# Altium schematic sheet C-10 PMIC.SchDoc
size 513 x 386 mm; Address1: 350W 9th Ave; Address2: Suite 206; Address3: Escondido CA 92025; Address4: United States; Revision: -; ENG_APP_DATE: --/--/--; DSN_APP_DATE: --/--/--; CHK_APP_DATE: --/--/--
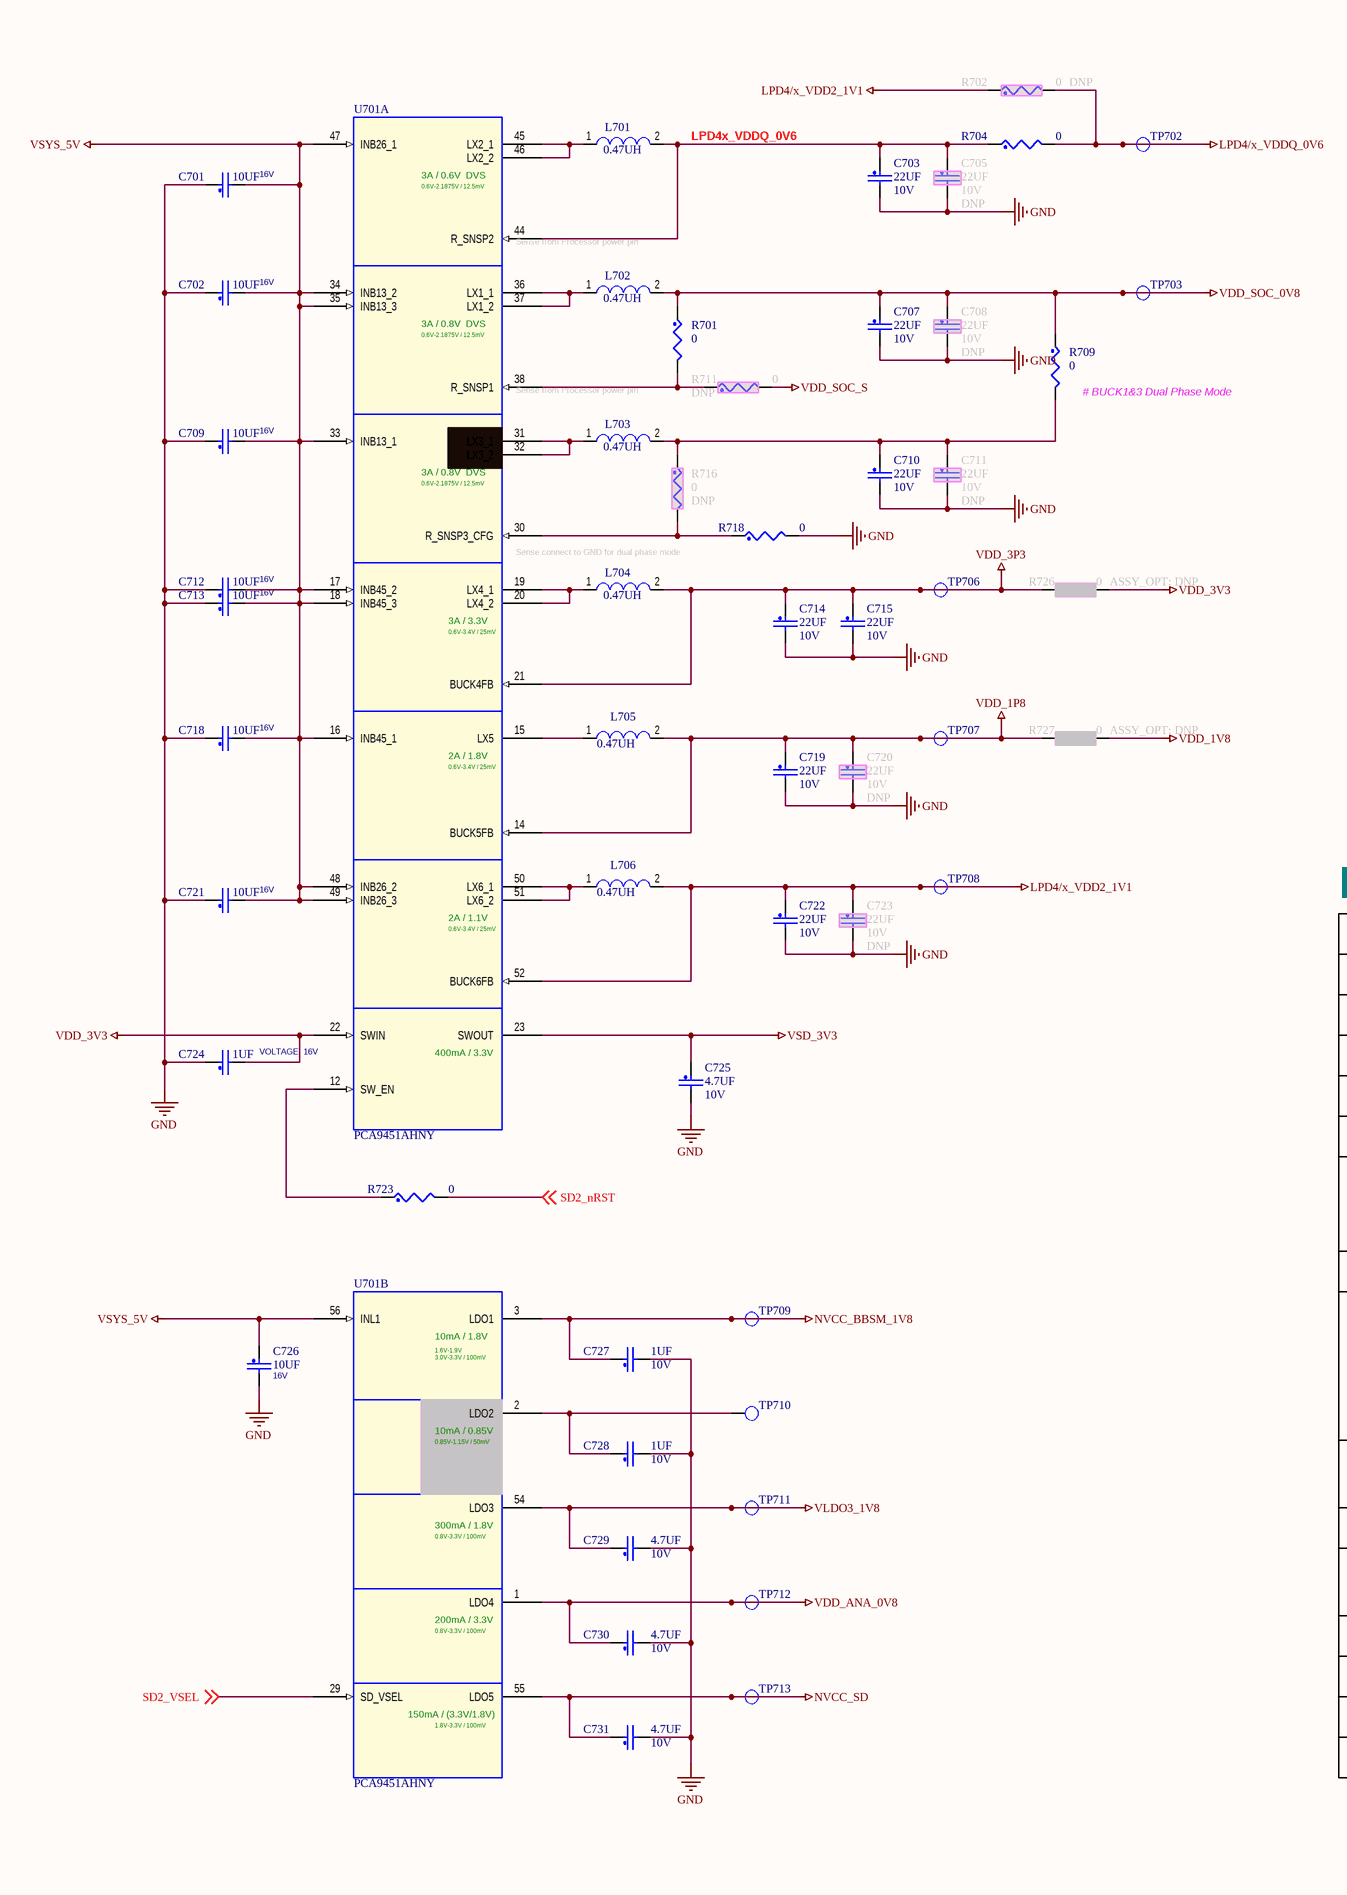
[diagram p0: C-10 PMIC.SchDoc, left]
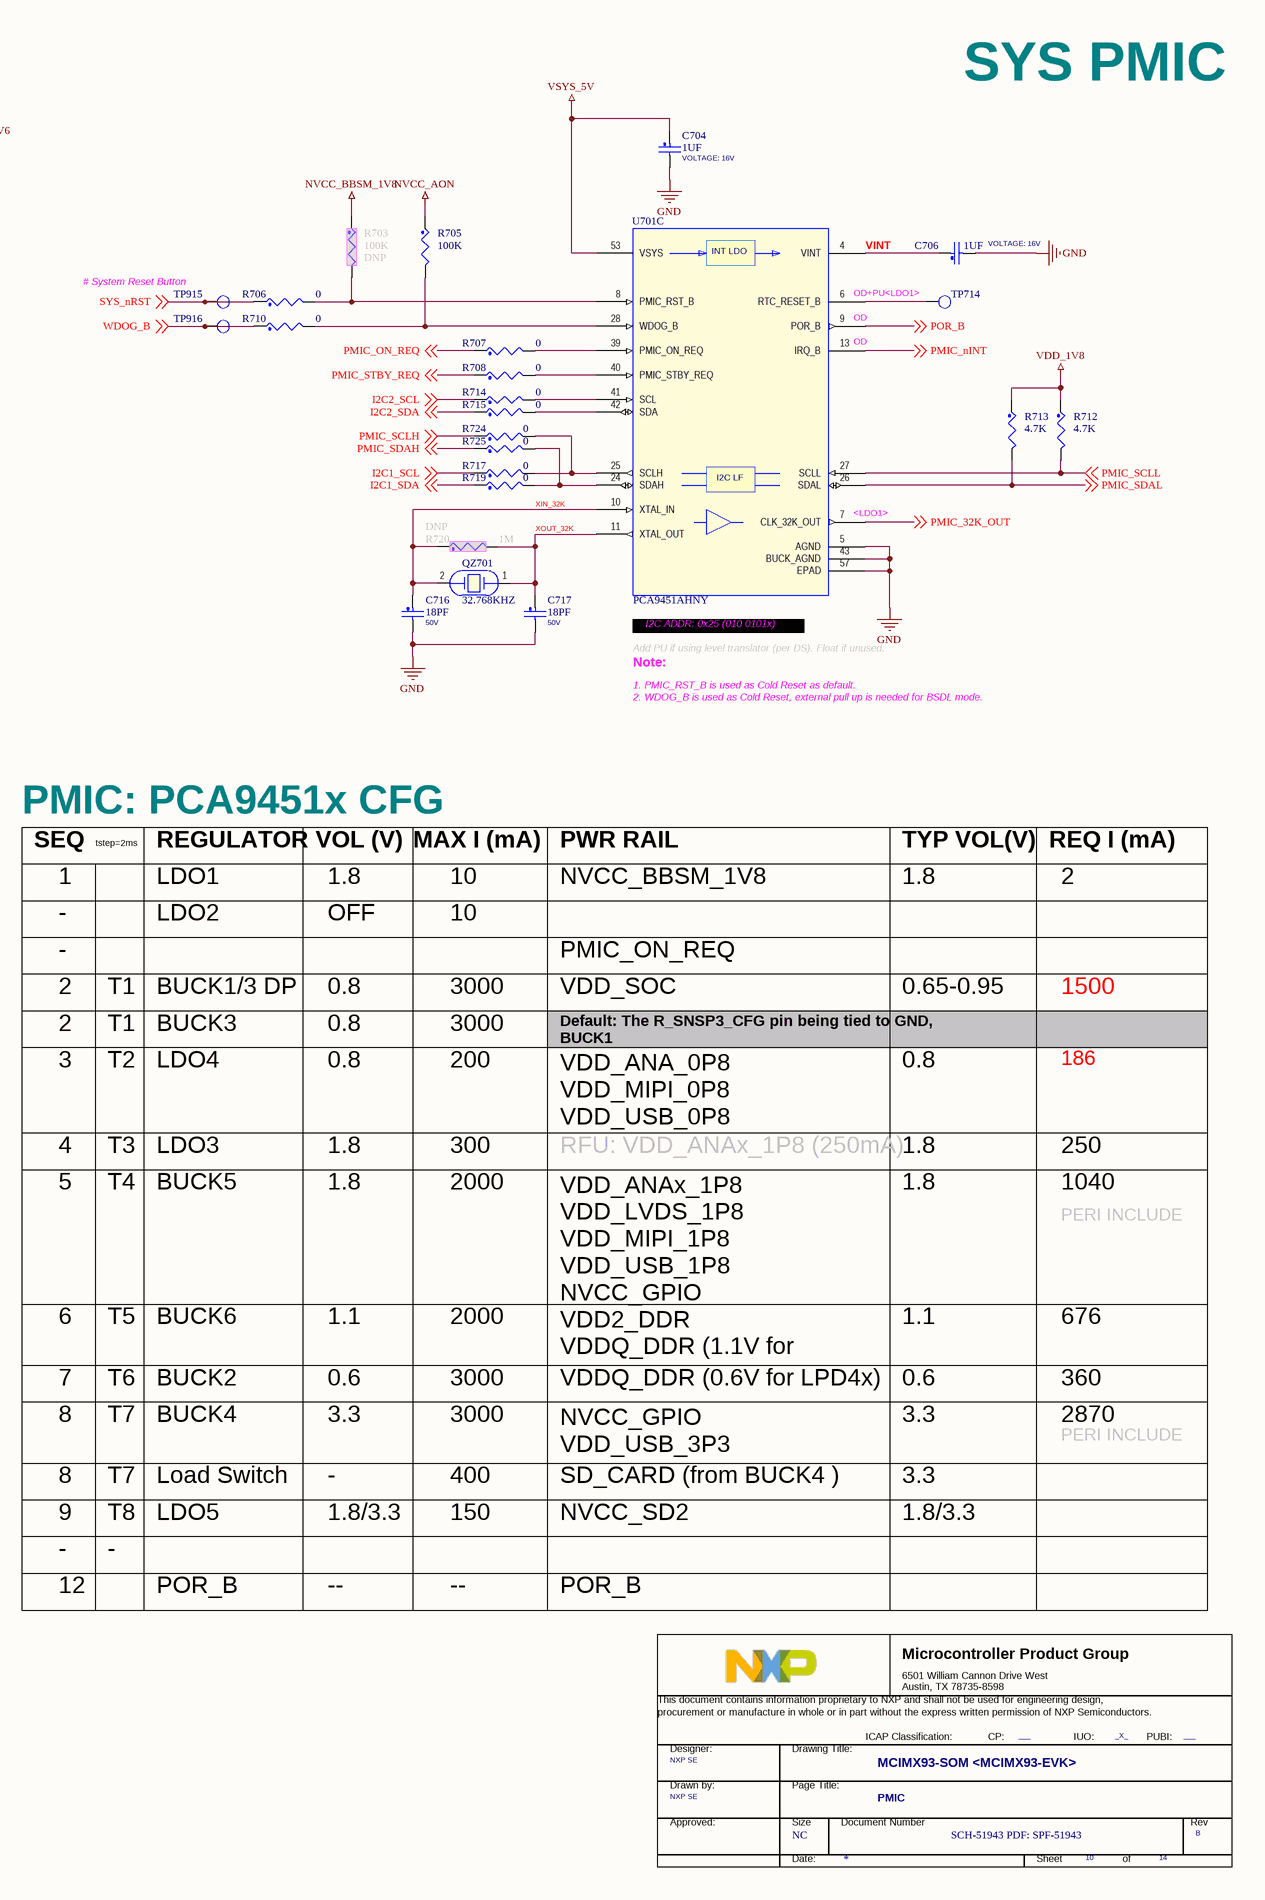
[diagram p1: C-10 PMIC.SchDoc, right]

## Parts
*  Doc: SCH-51943 PDF: SPF-51943  RevCode: B  Title: MCIMX93-SOM <MCIMX93-EVK>  Page Size: NC  Page Number: 10  Page Count: 14  PageTitle: PMIC  Designer: NXP SE  PUBI: ___  FIUO: _X_  (hidden comment: TitleBlock_MCPG)  (graphical)
C701  10UF  VOLTAGE: 16V  [CC0603]
C702  10UF  VOLTAGE: 16V  [CC0603]
C703  22UF  VOLTAGE: 10V  [CC0603]
C704  1UF  VOLTAGE: 16V  [0402_CC]
C705  22UF  ASSY_OPT: DNP  VOLTAGE: 10V  [CC0603]
C706  1UF  VOLTAGE: 16V  [0402_CC]
C707  22UF  VOLTAGE: 10V  [CC0603]
C708  22UF  ASSY_OPT: DNP  VOLTAGE: 10V  [CC0603]
C709  10UF  VOLTAGE: 16V  [CC0603]
C710  22UF  VOLTAGE: 10V  [CC0603]
C711  22UF  ASSY_OPT: DNP  VOLTAGE: 10V  [CC0603]
C712  10UF  VOLTAGE: 16V  [CC0603]
C713  10UF  VOLTAGE: 16V  [CC0603]
C714  22UF  VOLTAGE: 10V  [CC0603]
C715  22UF  VOLTAGE: 10V  [CC0603]
C716  18PF  VOLTAGE: 50V  [0201_CC]
C717  18PF  VOLTAGE: 50V  [0201_CC]
C718  10UF  VOLTAGE: 16V  [CC0603]
C719  22UF  VOLTAGE: 10V  [CC0603]
C720  22UF  ASSY_OPT: DNP  VOLTAGE: 10V  [CC0603]
C721  10UF  VOLTAGE: 16V  [CC0603]
C722  22UF  VOLTAGE: 10V  [CC0603]
C723  22UF  ASSY_OPT: DNP  VOLTAGE: 10V  [CC0603]
C724  1UF  VOLTAGE: 16V  [0402_CC]
C725  4.7UF  VOLTAGE: 10V  [cc0402_tol0p15]
C726  10UF  VOLTAGE: 16V  [CC0603]
C727  1UF  VOLTAGE: 10V  [0201_CC]
C728  1UF  VOLTAGE: 10V  [0201_CC]
C729  4.7UF  VOLTAGE: 10V  [cc0402_tol0p15]
C730  4.7UF  VOLTAGE: 10V  [cc0402_tol0p15]
C731  4.7UF  VOLTAGE: 10V  [cc0402_tol0p15]
L701  0.47UH  [ind_sph2520]
L702  0.47UH  [ind_sph2520]
L703  0.47UH  [ind_sph2520]
L704  0.47UH  [ind_sph2520]
L705  0.47UH  [IND_2016A]
L706  0.47UH  [IND_2016A]
QZ701  32.768KHZ  [XTAL2-3P2X1P5-SM]
R701  0  [0402_CC]
R702  0  ASSY_OPT: DNP  [0603_CC]
R703  100K  ASSY_OPT: DNP  [0402_CC]
R704  0  [0603_CC]
R705  100K  [0402_CC]
R706  0  [0402_CC]
R707  0  [0402_CC]
R708  0  [0402_CC]
R709  0  [0603_CC]
R710  0  [0402_CC]
R711  0  ASSY_OPT: DNP  [0402_CC]
R712  4.7K  [0402_CC]
R713  4.7K  [0402_CC]
R714  0  [0402_CC]
R715  0  [0402_CC]
R716  0  ASSY_OPT: DNP  [0402_CC]
R717  0  [0201_CC]
R718  0  [0402_CC]
R719  0  [0201_CC]
R720  1M  ASSY_OPT: DNP  [0201_CC]
R723  0  [0402_CC]
R724  0  [0201_CC]
R725  0  [0201_CC]
R726  0  ASSY_OPT: DNP  [RC0805_OV]
R727  0  ASSY_OPT: DNP  [RC0805_OV]
TP702  TP_35MIL  [testpoint_35mil]  (value not drawn)  (no BOM)
TP703  TP_35MIL  [testpoint_35mil]  (value not drawn)  (no BOM)
TP706  TP_35MIL  [testpoint_35mil]  (value not drawn)  (no BOM)
TP707  TP_35MIL  [testpoint_35mil]  (value not drawn)  (no BOM)
TP708  TP_35MIL  [testpoint_35mil]  (value not drawn)  (no BOM)
TP709  TP_35MIL  [testpoint_35mil]  (value not drawn)  (no BOM)
TP710  TP_35MIL  [testpoint_35mil]  (value not drawn)  (no BOM)
TP711  TP_35MIL  [testpoint_35mil]  (value not drawn)  (no BOM)
TP712  TP_35MIL  [testpoint_35mil]  (value not drawn)  (no BOM)
TP713  TP_35MIL  [testpoint_35mil]  (value not drawn)  (no BOM)
TP714  TP_35MIL  [testpoint_35mil]  (value not drawn)  (no BOM)
TP915  TP_35MIL  [testpoint_35mil]  (value not drawn)  (no BOM)
TP916  TP_35MIL  [testpoint_35mil]  (value not drawn)  (no BOM)
U701  PCA9451AHNY  [hvqfn56_0p4_7x7_ep4p7mm]  (parts A,B,C of 3)

## Nets
GND: C701.1 C702.1 C703.2 C704.2 C705.2 C706.2 C707.2 C708.2 C709.1 C710.2 C711.2 C712.1 C713.1 C714.2 C715.2 C716.2 C717.2 C718.1 C719.2 C720.2 C721.1 C722.2 C723.2 C724.1 C725.2 C726.2 C727.2 C728.2 C729.2 C730.2 C731.2 R718.2 U701.5(AGND) U701.43(BUCK_AGND) U701.57(EPAD)
LPD4/x_VDD2_1V1: C722.1 C723.1 L706.2 R702.1 TP708.1(TP) U701.52(BUCK6FB)
LPD4/x_VDDQ_0V6: R702.2 R704.2 TP702.1(TP)
NVCC_AON: R705.1
NVCC_BBSM_1V8: C727.1 R703.1 TP709.1(TP) U701.3(LDO1)
NVCC_SD: C731.1 TP713.1(TP) U701.55(LDO5)
VDD_1P8: C719.1 C720.1 L705.2 R727.1 TP707.1(TP) U701.14(BUCK5FB)
VDD_1V8: R712.1 R713.1 R727.2
VDD_3P3: C714.1 C715.1 L704.2 R726.1 TP706.1(TP) U701.21(BUCK4FB)
VDD_3V3: C724.2 R726.2 U701.22(SWIN)
VDD_ANA_0V8: C730.1 TP712.1(TP) U701.1(LDO4)
VDD_SOC_0V8: C707.1 C708.1 L702.2 R701.1 R709.1 TP703.1(TP)
VDD_SOC_S: R711.2
VLDO3_1V8: C729.1 TP711.1(TP) U701.54(LDO3)
VSD_3V3: C725.1 U701.23(SWOUT)
VSYS_5V: C701.2 C702.2 C704.1 C709.2 C712.2 C713.2 C718.2 C721.2 C726.1 U701.16(INB45_1) U701.17(INB45_2) U701.18(INB45_3) U701.33(INB13_1) U701.34(INB13_2) U701.35(INB13_3) U701.47(INB26_1) U701.48(INB26_2) U701.49(INB26_3) U701.53(VSYS) U701.56(INL1)
I2C1_SCL: R717.1 ; off-sheet I2C1_SCL
I2C1_SDA: R719.1 ; off-sheet I2C1_SDA
I2C2_SCL: R714.1 ; off-sheet I2C2_SCL
I2C2_SDA: R715.1 ; off-sheet I2C2_SDA
LPD4x_VDDQ_0V6: C703.1 C705.1 L701.2 R704.1 U701.44(R_SNSP2)
PMIC_32K_OUT: U701.7(CLK_32K_OUT) ; off-sheet PMIC_32K_OUT
PMIC_nINT: U701.13(IRQ_B) ; off-sheet PMIC_nINT
PMIC_ON_REQ: R707.1 ; off-sheet PMIC_ON_REQ
PMIC_SCLH: R724.1 ; off-sheet PMIC_SCLH
PMIC_SCLL: R712.2 U701.27(SCLL) ; off-sheet PMIC_SCLL
PMIC_SDAH: R725.1 ; off-sheet PMIC_SDAH
PMIC_SDAL: R713.2 U701.26(SDAL) ; off-sheet PMIC_SDAL
PMIC_STBY_REQ: R708.1 ; off-sheet PMIC_STBY_REQ
POR_B: U701.9(POR_B) ; off-sheet POR_B
SD2_nRST: R723.2 ; off-sheet SD2_nRST
SD2_VSEL: U701.29(SD_VSEL) ; off-sheet SD2_VSEL
SYS_nRST: R706.1 TP915.1(TP) ; off-sheet SYS_nRST
VINT: C706.1 U701.4(VINT)
WDOG_B: R710.1 TP916.1(TP) ; off-sheet WDOG_B
XIN_32K: C716.1 QZ701.2 R720.1 U701.10(XTAL_IN)
XOUT_32K: C717.1 QZ701.1 R720.2 U701.11(XTAL_OUT)
NetC710_1: C710.1 C711.1 L703.2 R709.2 R716.1
NetC728_1: C728.1 TP710.1(TP) U701.2(LDO2)
NetL701_1: L701.1 U701.45(LX2_1) U701.46(LX2_2)
NetL702_1: L702.1 U701.36(LX1_1) U701.37(LX1_2)
NetL703_1: L703.1 U701.31(LX3_1) U701.32(LX3_2)
NetL704_1: L704.1 U701.19(LX4_1) U701.20(LX4_2)
NetL705_1: L705.1 U701.15(LX5)
NetL706_1: L706.1 U701.50(LX6_1) U701.51(LX6_2)
NetR701_2: R701.2 R711.1 U701.38(R_SNSP1)
NetR703_2: R703.2 R706.2 U701.8(PMIC_RST_B)
NetR705_2: R705.2 R710.2 U701.28(WDOG_B)
NetR707_2: R707.2 U701.39(PMIC_ON_REQ)
NetR708_2: R708.2 U701.40(PMIC_STBY_REQ)
NetR714_2: R714.2 U701.41(SCL)
NetR715_2: R715.2 U701.42(SDA)
NetR716_2: R716.2 R718.1 U701.30(R_SNSP3_CFG)
NetR717_2: R717.2 R724.2 U701.25(SCLH)
NetR719_2: R719.2 R725.2 U701.24(SDAH)
NetR723_1: R723.1 U701.12(SW_EN)
NetTP714_1: TP714.1(TP) U701.6(RTC_RESET_B)

## Notes on the sheet
- SYS PMIC
- (near U701) 3A / 0.6V  DVS
- (near U701) 0.6V-2.1875V / 12.5mV
- (near U701) Sense from Processor power pin
- (near U701) 3A / 0.8V  DVS
- # System Reset Button
- OD+PU<LDO1>
- (near R709) # BUCK1&3 Dual Phase Mode
- (near U701) OD
- (near U701) Sense connect to GND for dual phase mode
- (near U701) <LDO1>
- (near U701) 0.6V-3.4V / 25mV
- (near U701) 3A / 3.3V
- Note:
- Add PU if using level translator (per DS). Float if unused.
- I2C ADDR: 0x25 (010 0101x)
- (near U701) 2A / 1.8V
- 1. PMIC_RST_B is used as Cold Reset as default.
- 2. WDOG_B is used as Cold Reset, external pull up is needed for BSDL mode.
- (near U701) 2A / 1.1V
- PMIC: PCA9451x CFG
- SEQ
- tstep=2ms
- REGULATOR
- VOL (V)
- MAX I (mA)
- PWR RAIL
- TYP VOL(V)
- REQ I (mA)
- -
- 1
- LDO1
- LDO2
- OFF
- 1.8
- 10
- NVCC_BBSM_1V8
- 2
- (near U701) 400mA / 3.3V
- PMIC_ON_REQ
- T1
- BUCK1/3 DP
- BUCK3
- 0.8
- 3000
- VDD_SOC
- Default: The R_SNSP3_CFG pin being tied to GND, BUCK1
  and BUCK3 are configured as dual phase mode. Curr 6A.
- 0.65-0.95
- 1500
- 3
- T2
- LDO4
- 200
- 186
- 4
- T3
- LDO3
- 300
- RFU: VDD_ANAx_1P8 (250mA)
- VDD_ANA_0P8
  VDD_MIPI_0P8
  VDD_USB_0P8
- 250
- (near U701) 1.6V-1.9V
  3.0V-3.3V / 100mV
- (near U701) 10mA / 1.8V
- 5
- T4
- BUCK5
- 2000
- 1040
- PERI INCLUDE
- (near U701) 0.85V-1.15V / 50mV
- (near U701) 10mA / 0.85V
- 6
- T5
- BUCK6
- 1.1
- VDD2_DDR
  VDDQ_DDR (1.1V for LPD4)
- VDD_ANAx_1P8
  VDD_LVDS_1P8
  VDD_MIPI_1P8
  VDD_USB_1P8
  NVCC_GPIO
- 676
- (near U701) 0.8V-3.3V / 100mV
- (near U701) 300mA / 1.8V
- 7
- T6
- BUCK2
- 0.6
- VDDQ_DDR (0.6V for LPD4x)
- 360
- (near U701) 200mA / 3.3V
- 8
- T7
- BUCK4
- 3.3
- NVCC_GPIO
  VDD_USB_3P3
- 2870
- 9
- T8
- LDO5
- Load Switch
- 1.8/3.3
- 150
- 400
- SD_CARD (from BUCK4 )
- NVCC_SD2
- (near U701) 150mA / (3.3V/1.8V)
- (near U701) 1.8V-3.3V / 100mV
- 12
- POR_B
- --
- REVISION
- DESCRIPTION
- DATE
- APPROVED
- F
- E
- D
- C
- B
- PROJECT:
- REV.
- ENG:
- APPROVALS
- PROJECT
- JordanDSP LLC <https://www.jordandsp.com>
- Envision Excellence
- SHT.
- A
- DSN:
- CHK:
- REFERENCE ITEMS
- PRJ VCS REVISION:
- TITLE
- DOC VCS REVISION:
- MODIFIED DATE:
- BOM:
- FAB DWG:
- FIRMWARE:
- ASSY DWG:
- SCALE:
- SIZE
- CAGE CODE
- FILE NAME
- DWG NO.
- PAGE
- PRODUCT REV
- OF
- (in symbol PCA9451AHNY, part C) INT LDO; I2C LF
- (in symbol TitleBlock_MCPG) Microcontroller Product Group; 6501 William Cannon Drive West / Austin, TX 78735-8598; This document contains information proprietary to NXP and shall not be used for engineering design,; procurement or manufacture in whole or in part without the express written permission of NXP Semiconductors.; ICAP Classification:; CP:; IUO:; PUBI:; Designer:; Drawing Title:; Drawn by:; Page Title:; Approved:; Size; Document Number; Rev; Date:; Sheet; of

## Library data of the parts
* = TitleBlock_MCPG: OrgAddr1: NO. 192 Liangjing Rd. Pudong New Area, ShangHai; OrgName: NXP Semiconductor; Page Create Date: March  8, 1995; DrawnBy: NXP SE; FCP: ___; Page Modify Date: *
C701 C726 = CAP_NP: CAP CER 10.0uF 16V 10% X5R 0603; CLASS: DISCRETE; AGILE_PN: 150-80060; MFG_NAME01: MURATA; MFG_PN01: GRM188R61C106KAALD; Temp_Range: -55¡ãC to +85¡ãC; CAD_APPROVED: Yes; FPLIST: CC0603_OV,CC0603,0603_CC,cc0603_0805_nsp; PCB Footprint: CC0603; Tolerance: 10%; ROHS: Yes; HEIGHT: 0.9MM; Package Size: 0603; Package Type: SMT; Temp Range: -55¡ãC to +85¡ãC
C702 C709 C713 = CAP_NP: CAP CER 10.0uF 16V 10% X5R 0603; CLASS: DISCRETE; FPLIST: CC0603_OV,CC0603,0603_CC,cc0603_0805_nsp; CAD_APPROVED: Yes; Temp_Range: -55¡ãC to +85¡ãC; MFG_PN01: GRM188R61C106KAALD; MFG_NAME01: MURATA; AGILE_PN: 150-80060; PCB Footprint: CC0603; HEIGHT: 0.9MM; ROHS: Yes; Tolerance: 10%; Package Size: 0603; Package Type: SMT; Temp Range: -55¡ãC to +85¡ãC
C703 C710 C714 C719 C722 = CAP_NP: CAP CER 22uF 10V 20% X5R 0603; CLASS: DISCRETE; FPLIST: CC0603_OV,CC0603,0603_cc_tol; CAD_APPROVED: Yes; MFG_PN01: C1608X5R1A226M080AC; MFG_NAME01: TDK; AGILE_PN: 150-79530; WVDC: 6.3V; SIGNAL_MODEL: DEFAULT_CAPACITOR_2.2e+07pF_2_1; PCB Footprint: CC0603; HEIGHT: 1MM; ROHS: Yes; Tolerance: 20%; Package Size: 0603
C704 C724 = CAP_NP: CAP CER 1uF 16V 10% X5R 0402; CLASS: DISCRETE; AGILE_PN: 150-78973; FPLIST: CC0402_25,CC0402_HD,0402_CC,capc0402_l; CAD_APPROVED: Yes; MFG_NAME01: YAGEO; MFG_PN01: CC0402KRX5R7BB105; HEIGHT: 0.55 MM; Tolerance: 10%; ROHS: Yes; PCB Footprint: 0402_CC
C705 C711 C723 = CAP_NP: CAP CER 22uF 10V 20% X5R 0603; CLASS: DISCRETE; SIGNAL_MODEL: DEFAULT_CAPACITOR_2.2e+07pF_2_1; FPLIST: CC0603_OV,CC0603,0603_cc_tol; CAD_APPROVED: Yes; MFG_PN01: C1608X5R1A226M080AC; MFG_NAME01: TDK; AGILE_PN: 150-79530; WVDC: 6.3V; HEIGHT: 1MM; ROHS: Yes; Tolerance: 20%; Package Size: 0603; PCB Footprint: CC0603
C706 = CAP_NP: CAP CER 1uF 16V 10% X5R 0402; CLASS: DISCRETE; MFG_PN01: CC0402KRX5R7BB105; MFG_NAME01: YAGEO; CAD_APPROVED: Yes; FPLIST: CC0402_25,CC0402_HD,0402_CC,capc0402_l; AGILE_PN: 150-78973; ROHS: Yes; Tolerance: 10%; HEIGHT: 0.55 MM; PCB Footprint: 0402_CC
C707 = CAP_NP: CAP CER 22uF 10V 20% X5R 0603; CLASS: DISCRETE; SIGNAL_MODEL: DEFAULT_CAPACITOR_2.2e+07pF_2_1; WVDC: 6.3V; AGILE_PN: 150-79530; MFG_NAME01: TDK; MFG_PN01: C1608X5R1A226M080AC; CAD_APPROVED: Yes; FPLIST: CC0603_OV,CC0603,0603_cc_tol; PCB Footprint: CC0603; Tolerance: 20%; ROHS: Yes; HEIGHT: 1MM; Package Size: 0603
C708 C715 C720 = CAP_NP: CAP CER 22uF 10V 20% X5R 0603; CLASS: DISCRETE; WVDC: 6.3V; AGILE_PN: 150-79530; MFG_NAME01: TDK; MFG_PN01: C1608X5R1A226M080AC; CAD_APPROVED: Yes; FPLIST: CC0603_OV,CC0603,0603_cc_tol; SIGNAL_MODEL: DEFAULT_CAPACITOR_2.2e+07pF_2_1; Package Size: 0603; Tolerance: 20%; ROHS: Yes; HEIGHT: 1MM; PCB Footprint: CC0603
C712 C718 C721 = CAP_NP: CAP CER 10.0uF 16V 10% X5R 0603; CLASS: DISCRETE; Temp Range: -55¡ãC to +85¡ãC; AGILE_PN: 150-80060; MFG_NAME01: MURATA; MFG_PN01: GRM188R61C106KAALD; CAD_APPROVED: Yes; FPLIST: CC0603_OV,CC0603,0603_CC,cc0603_0805_nsp; PCB Footprint: CC0603; Package Type: SMT; Package Size: 0603; Tolerance: 10%; ROHS: Yes; Temp_Range: -55¡ãC to +85¡ãC; HEIGHT: 0.9MM
C716 C717 = CAP_NP: CAP CER 18pF 50V 5% C0G 0201; CLASS: DISCRETE; AGILE_PN: 150-79476; MFG_NAME01: MURATA; MFG_PN01: GRM0335C1H180JA01D; CAD_APPROVED: Yes; FPLIST: CC0201,CC0201_HD,0201_CC; Tolerance: 5%; ROHS: Yes; HEIGHT: 0.33MM; Package Size: 0201; Package Type: &#966;180mm Paper taping; PCB Footprint: 0201_CC
C725 = CAP_NP: CAP CER 4.7uF 10V 10% X5R 0402; CLASS: DISCRETE; AGILE_PN: 150-80044; MFG_NAME01: SAMSUNG ELECTRO MECHANICS; MFG_PN01: CL05A475KP5NRNC; CAD_APPROVED: Yes; FPLIST: cc0402_tol0p15,cc0402_tol0p15_ov,0402_cc_nsp; Tolerance: 10%; ROHS: Yes; HEIGHT: 0.65MM; PCB Footprint: cc0402_tol0p15; 3D_Mechanical_Footprint_File: cc0402_tol0p15
C727 C728 = CAP_NP: CAP CER 1.0uF 10V 10% X5R 0201; CLASS: DISCRETE; Temp Range: -55¡ãC to 85¡ãC; FPLIST: CC0201,CC0201_HD,0201_CC,cc_0201_cir; CAD_APPROVED: Yes; MFG_PN01: CL03A105KP3NSNC; MFG_NAME01: SAMSUNG ELECTRO MECHANICS; AGILE_PN: 150-81088; Package Type: SMD/SMT; Package Size: 0201 (0603 Metric); HEIGHT: 0.35MM; ROHS: Yes; Tolerance: 10%; PCB Footprint: 0201_CC
C729-C731 = CAP_NP: CAP CER 4.7uF 10V 10% X5R 0402; CLASS: DISCRETE; FPLIST: cc0402_tol0p15,cc0402_tol0p15_ov,0402_cc_nsp; CAD_APPROVED: Yes; MFG_PN01: CL05A475KP5NRNC; MFG_NAME01: SAMSUNG ELECTRO MECHANICS; AGILE_PN: 150-80044; HEIGHT: 0.65MM; ROHS: Yes; Tolerance: 10%; PCB Footprint: cc0402_tol0p15; 3D_Mechanical_Footprint_File: cc0402_tol0p15
L701 = INDUCTOR: IND PWR 0.47uH@1MHZ 4.7A 20% SMT; PART_TYPE: INDUCTOR\POWER; CLASS: DISCRETE; CAD_APPROVED: Yes; Temp_Range: -40¡ãC to +125¡ãC; MFG_PN01: WPN252012ER47MT; MFG_NAME01: SHENZHEN SUNLORD ELECTRONICS CO., LTD; AGILE_PN: 180-78647; PCB Footprint: ind_sph2520; Tolerance: 20%; HEIGHT: 1.2MM; ROHS: Yes; TOL: 20%; Temp Range: -40¡ãC to +125¡ãC
L702-L704 = INDUCTOR: IND PWR 0.47uH@1MHZ 4.7A 20% SMT; PART_TYPE: INDUCTOR\POWER; CLASS: DISCRETE; Temp Range: -40¡ãC to +125¡ãC; AGILE_PN: 180-78647; MFG_NAME01: SHENZHEN SUNLORD ELECTRONICS CO., LTD; MFG_PN01: WPN252012ER47MT; CAD_APPROVED: Yes; PCB Footprint: ind_sph2520; Tolerance: 20%; TOL: 20%; ROHS: Yes; Temp_Range: -40¡ãC to +125¡ãC; HEIGHT: 1.2MM
L705 = INDUCTOR: IND PWR 0.47uH@1MHz 3.4A 20% 2016; PART_TYPE: INDUCTOR\POWER; CLASS: DISCRETE; Temp Range: -40¡ãC to 125¡ãC; CAD_APPROVED: Yes; MFG_PN01: WPN201612HR47MT; MFG_NAME01: SHENZHEN SUNLORD ELECTRONICS CO., LTD; AGILE_PN: 180-78995; PCB Footprint: IND_2016A; Package Size: 2x1.6x1.2 mm; HEIGHT: 1.2MM; Temp_Range: -40¡ãC to 125¡ãC; ROHS: Yes; Tolerance: 20%
L706 = INDUCTOR: IND PWR 0.47uH@1MHz 3.4A 20% 2016; PART_TYPE: INDUCTOR\POWER; CLASS: DISCRETE; Temp Range: -40¡ãC to 125¡ãC; AGILE_PN: 180-78995; MFG_NAME01: SHENZHEN SUNLORD ELECTRONICS CO., LTD; MFG_PN01: WPN201612HR47MT; CAD_APPROVED: Yes; PCB Footprint: IND_2016A; Package Size: 2x1.6x1.2 mm; Tolerance: 20%; ROHS: Yes; Temp_Range: -40¡ãC to 125¡ãC; HEIGHT: 1.2MM
QZ701 = XTAL: XTAL 32.768KHZ 12.5PF 20PPM 3.2X1.5MM SMT; CLASS: IC; CAD_APPROVED: Yes; MFG_PN01: ABS07-32.768KHZ-T; MFG_NAME01: Abracon Corporation; AGILE_PN: 230-77653; HEIGHT: 0.9MM; ROHS: Yes; PCB Footprint: XTAL2-3P2X1P5-SM
R701 R706 R714 R715 = RES: RES MF ZERO OHM 1/16W 5% 0402; CLASS: DISCRETE; AGILE_PN: 470-75394; MFG_NAME01: YAGEO AMERICA; MFG_PN01: RC0402JR-070RL; CAD_APPROVED: Yes; FPLIST: RC0402_25,RC0402_HD,RC0402_X2,0402_CC; PCB Footprint: 0402_CC; VOLTAGE: 1/16W; Tolerance: 5%; ROHS: Yes; HEIGHT: 0.45 MM
R702 R709 = RES: RES MF ZERO OHM 1/10W -- 0603; CLASS: DISCRETE; AGILE_PN: 470-80866; MFG_NAME01: WALSIN TECHNOLOGY CORP.; MFG_PN01: WR06X000PTL; CAD_APPROVED: Yes; FPLIST: RC0603_OV,RC0603,R603-X2,0603_CC,IND_0603HP_NSP,CC0603_OV_NSP; Temp Range: ¨C55 ¡ãC to +155 ¡ãC; PCB Footprint: 0603_CC; ROHS: Yes; HEIGHT: 0.6MM
R703 = RES: RES MF 100K 1/16W 5% 0402; CLASS: DISCRETE; AGILE_PN: 470-75597; MFG_NAME01: VENKEL COMPANY; MFG_PN01: CR0402-16W-104JT; CAD_APPROVED: Yes; FPLIST: RC0402_25,RC0402_HD,0402_CC; VOLTAGE: 50V; Temp Range: -55C to +155C; PCB Footprint: 0402_CC; Tolerance: 5%; ROHS: Yes; HEIGHT: 0.40 MM
R704 = RES: RES MF ZERO OHM 1/10W -- 0603; CLASS: DISCRETE; Temp Range: ¨C55 ¡ãC to +155 ¡ãC; FPLIST: RC0603_OV,RC0603,R603-X2,0603_CC,IND_0603HP_NSP,CC0603_OV_NSP; CAD_APPROVED: Yes; MFG_PN01: WR06X000PTL; MFG_NAME01: WALSIN TECHNOLOGY CORP.; AGILE_PN: 470-80866; PCB Footprint: 0603_CC; HEIGHT: 0.6MM; ROHS: Yes
R705 = RES: RES MF 100K 1/16W 5% 0402; CLASS: DISCRETE; Temp Range: -55C to +155C; VOLTAGE: 50V; AGILE_PN: 470-75597; MFG_NAME01: VENKEL COMPANY; MFG_PN01: CR0402-16W-104JT; CAD_APPROVED: Yes; FPLIST: RC0402_25,RC0402_HD,0402_CC; PCB Footprint: 0402_CC; Tolerance: 5%; ROHS: Yes; HEIGHT: 0.40 MM
R707 R708 R710 R711 R716 R718 R723 = RES: RES MF ZERO OHM 1/16W 5% 0402; CLASS: DISCRETE; FPLIST: RC0402_25,RC0402_HD,RC0402_X2,0402_CC; CAD_APPROVED: Yes; MFG_PN01: RC0402JR-070RL; MFG_NAME01: YAGEO AMERICA; AGILE_PN: 470-75394; PCB Footprint: 0402_CC; HEIGHT: 0.45 MM; ROHS: Yes; Tolerance: 5%; VOLTAGE: 1/16W
R712 = RES: RES MF 4.7K 1/10W 5% AEC-Q200 0402; CLASS: DISCRETE; AGILE_PN: 470-82064; MFG_NAME01: KOA SPEER; MFG_PN01: RK73B1ETTP472J; Temp_Range: -55C to +155C; CAD_APPROVED: Yes; FPLIST: RC0402_25,RC0402_HD,0402_CC,RC0402_X2; VOLTAGE: 50V; PCB Footprint: 0402_CC; Tolerance: 5%; ROHS: Yes; HEIGHT: 0.41mm; Temp Range: -55C to +155C
R713 = RES: RES MF 4.7K 1/10W 5% AEC-Q200 0402; CLASS: DISCRETE; VOLTAGE: 50V; Temp Range: -55C to +155C; FPLIST: RC0402_25,RC0402_HD,0402_CC,RC0402_X2; CAD_APPROVED: Yes; MFG_PN01: RK73B1ETTP472J; MFG_NAME01: KOA SPEER; AGILE_PN: 470-82064; PCB Footprint: 0402_CC; HEIGHT: 0.41mm; Temp_Range: -55C to +155C; ROHS: Yes; Tolerance: 5%
R717 R719 R724 R725 = RES: RES MF ZERO OHM 1/20W -- 0201; CLASS: DISCRETE; AGILE_PN: 470-76631; MFG_NAME01: BOURNS; MFG_PN01: CR0201-J/-000GLF; CAD_APPROVED: Yes; FPLIST: RC0201,0201_CC,RC0201_X2; PCB Footprint: 0201_CC; ROHS: Yes; HEIGHT: 0.30 MM
R720 = RES: RES MF 1.0M 1/20W 5% AEC-Q200 0201; CLASS: DISCRETE; FPLIST: RC0201,0201_CC; CAD_APPROVED: Yes; Temp_Range: 55¡ãC ~ 125¡ãC; MFG_PN01: ERJ-1GNJ105C; MFG_NAME01: PANASONIC; AGILE_PN: 470-79975; VOLTAGE: 25V; PCB Footprint: 0201_CC; HEIGHT: 0.26MM; ROHS: Yes; Tolerance: 5%; Temp Range: 55¡ãC ~ 125¡ãC
R726 R727 = RES: RES MF ZERO OHM 1/8W -- 0805; CLASS: DISCRETE; MFG_PN01: RC0805JR-070RL; MFG_NAME01: YAGEO AMERICA; Temp Range: ¨C55 ¡ãC to +155 ¡ãC; CAD_APPROVED: Yes; Tolerance: 5%; FPLIST: RC0805_OV,RC0805,RC0805_OV_3P,0805_CC; AGILE_PN: 470-75442; ROHS: Yes; HEIGHT: 0.7 MM; PCB Footprint: RC0805_OV
TP702 TP703 TP706 TP708 TP709 TP711-TP714 = T POINT R: TEST POINT PAD .035 SMT, no part to order; ASSY_OPT: DNP; CLASS: IC; CAD_APPROVED: Yes; AGILE_PN: 510-75618; PCB Footprint: testpoint_35mil; HEIGHT: 0.1MM; ROHS: Yes
TP707 TP710 = T POINT R: TEST POINT PAD .035 SMT, no part to order; ASSY_OPT: DNP; CLASS: IC; AGILE_PN: 510-75618; CAD_APPROVED: Yes; PCB Footprint: testpoint_35mil; ROHS: Yes; HEIGHT: 0.1MM
TP915 TP916 = T POINT R: TEST POINT PAD .035 SMT, no part to order; CLASS: IC; AGILE_PN: 510-75618; CAD_APPROVED: Yes; PCB Footprint: testpoint_35mil; HEIGHT: 0.1MM; ROHS: Yes
U701 = PCA9451AHNY: IC POWER MANAGEMENT 2.7-5.5V HVQFN56; SWAP_INFO: (S1+S2+S3); SPLIT_INST: TRUE; AGILE_PN: TMP-CIP-8249; CAD_APPROVED: Yes; PRE_APN: 315-83273; MFG_NAME01: NXP SEMICONDUCTORS; 3D_Mechanical_Footprint_File: ftp://fcl.am.freescale.net/ALLEGRO/step/hvqfn56_0p4_7x7_ep4p7mm.step; CLASS: IC; PCB Footprint: hvqfn56_0p4_7x7_ep4p7mm; Package Size: 7x7; HEIGHT: 1MM; ROHS: Yes; MFG_PN01: PCA9451AHNY